# EAGLE design e407-eth-jack-replacment (EAGLE 6.4)
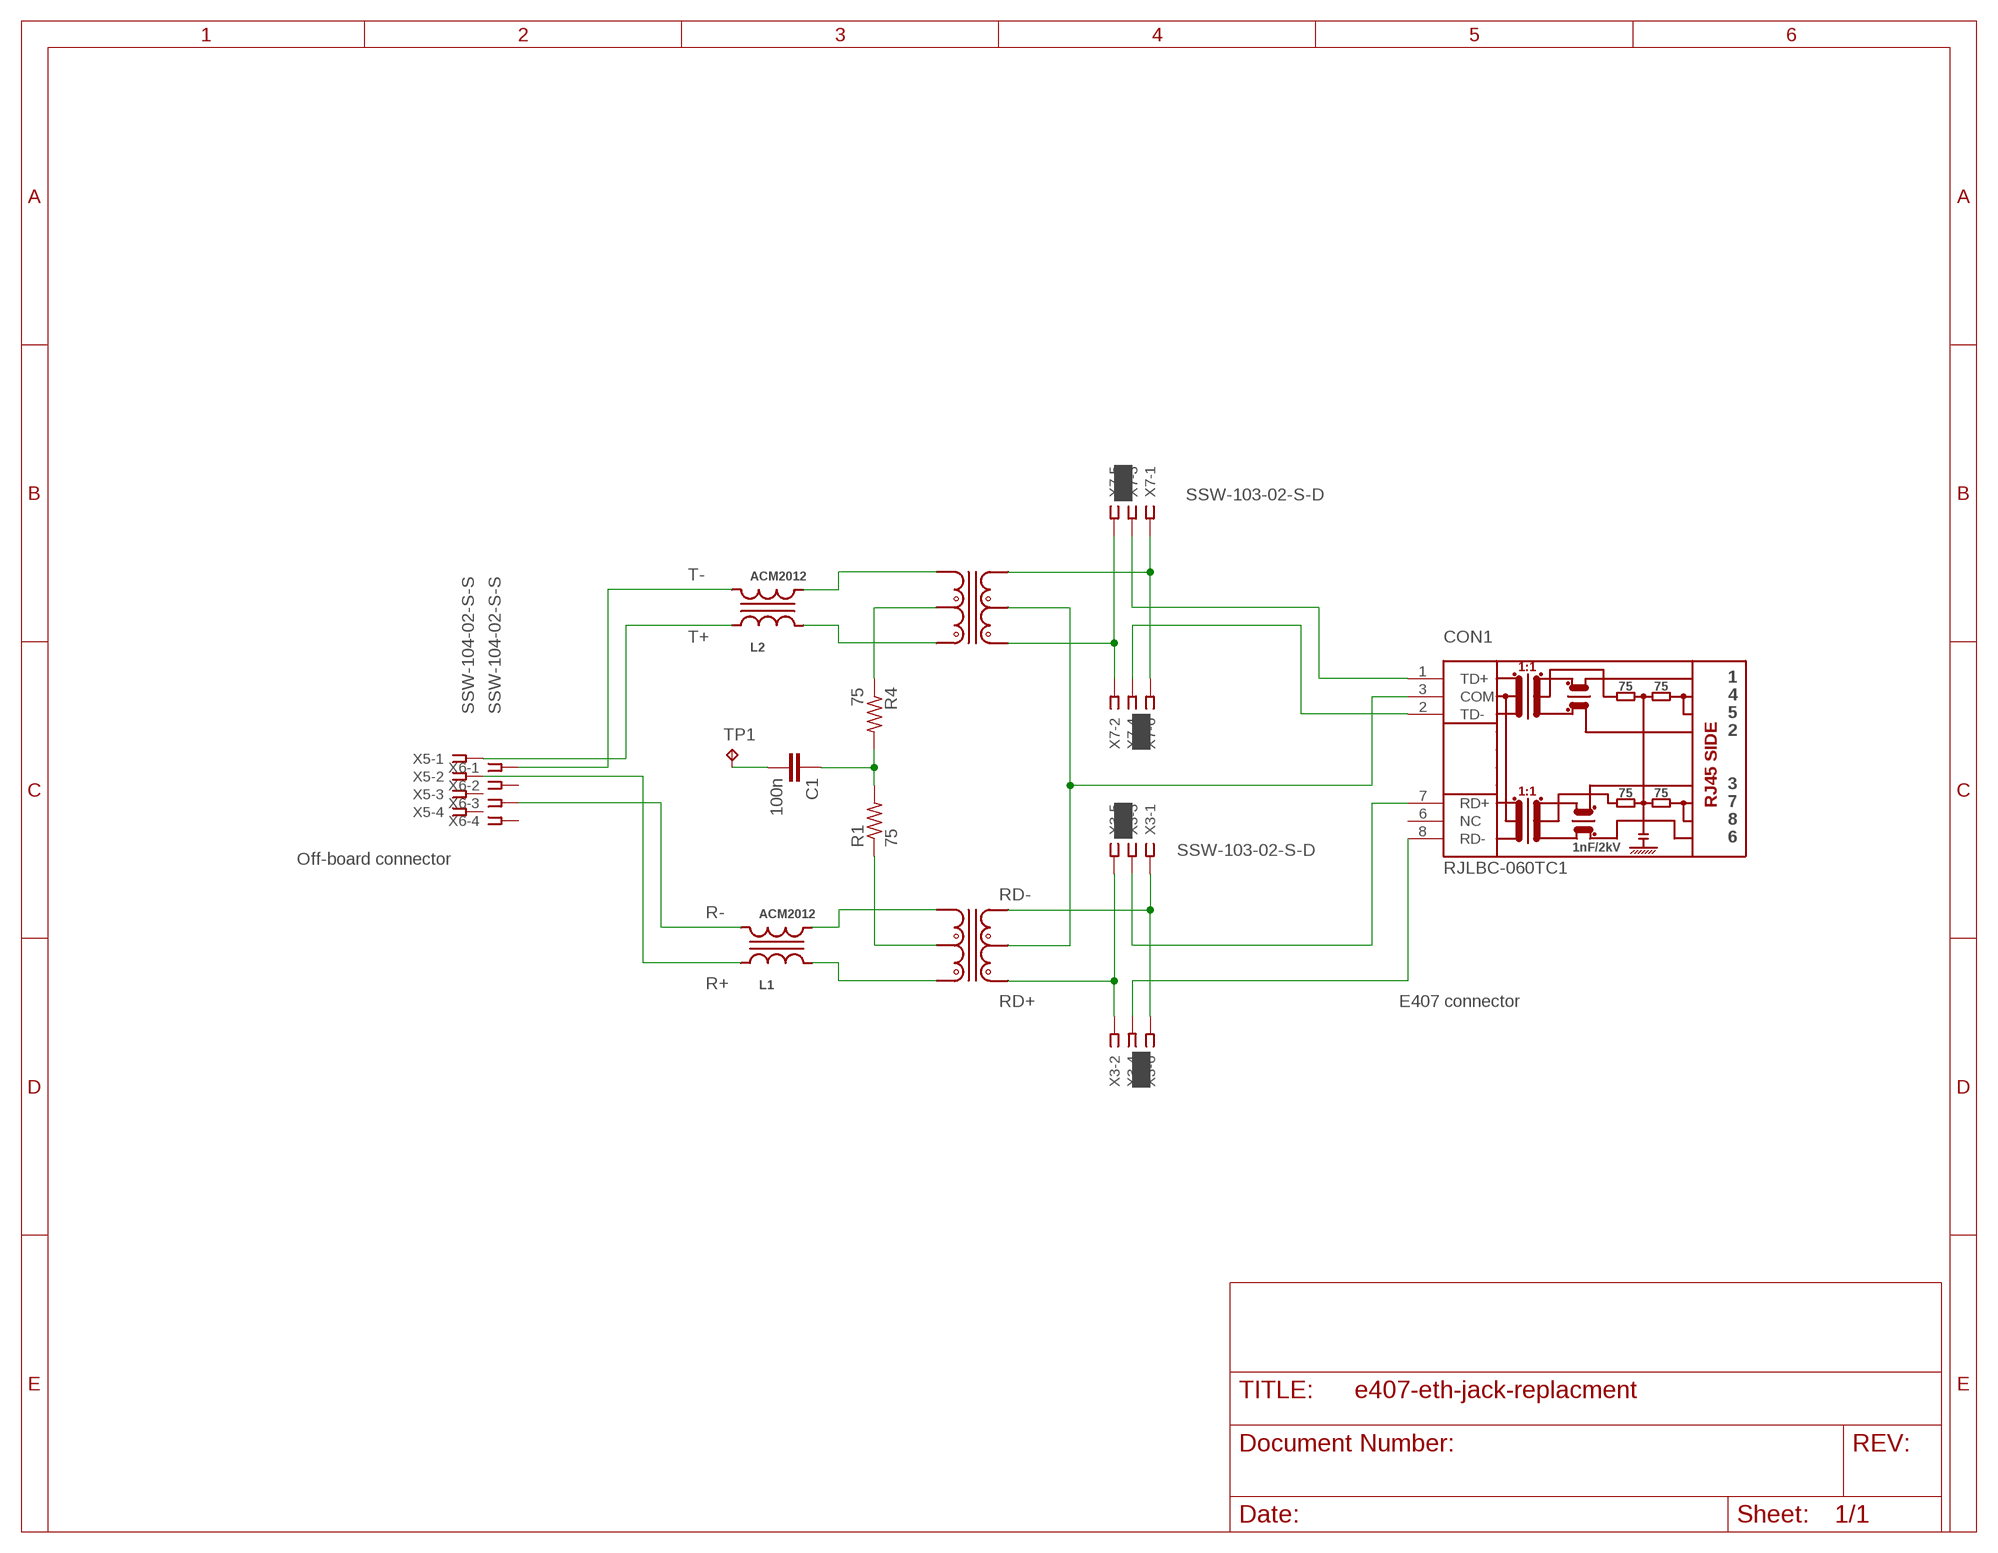
[diagram p0: schematic, sheet 1]

## Parts
C1  100n  C-EU0603-B-NOSILK  [0603-B-NOSILK]
CON1  RJLBC-060TC1  [RJLBC-060TC1]
L1  ACM2012  [TDK-ACM2012]
L2  ACM2012  [TDK-ACM2012]
R1  75  R-US_0603-B-NOSILK  [0603-B-NOSILK]
R4  75  R-US_0603-B-NOSILK  [0603-B-NOSILK]
T1  ALT4532  [TDK-ALT4532]
T2  ALT4532  [TDK-ALT4532]
TP1  TPPAD1-13  [P1-13]
X3  SSW-103-02-S-D  [SSW-103-02-S-D]
X5  SSW-104-02-S-S  [SSW-104-02-S-S]
X6  SSW-104-02-S-S  [SSW-104-02-S-S]
X7  SSW-103-02-S-D  [SSW-103-02-S-D]

## Nets
N$1: L1.3 T1.4
N$2: L2.4 T2.5
N$3: L2.1 X5.1
N$4: C1.1 R1.2 R4.2
N$5: L1.4 T1.5
N$6: CON1.8(RD-) X3.4
N$7: T1.2 X3.1 X3.6
N$9: T1.1 X3.2 X3.5
N$11: CON1.7(RD+) X3.3
N$12: CON1.1(TD+) X7.3
N$13: T2.1 X7.2 X7.5
N$14: L2.3 T2.4
N$15: L1.2 X6.3
N$17: L2.2 X6.1
N$18: C1.2 TP1.TP
N$21: CON1.2(TD-) X7.4
N$22: R4.1 T2.3
N$24: L1.1 X5.2
N$26: R1.1 T1.3
N$27: CON1.3(COM) T1.6 T2.6
N$31: T2.2 X7.1 X7.6
Unconnected: CON1.6(NC) X5.3 X5.4 X6.2 X6.4

## Notes on the sheet
- T-
- T+
- Off-board connector
- RD-
- R-
- R+
- RD+ | E407 connector

## Library data of the parts
C1 = rcl_custom:C-EU: CAPACITOR, European symbol
CON1 = OLIMEX_CONNECTORS:RJLBC-060TC1
L1 L2 = magnetics:ACM2012
R1 R4 = rcl_custom:R-US_: RESISTOR, American symbol
T1 T2 = alt4532:ALT4532
TP1 = testpad:TP: Test pad
X3 X7 = con-samtec:SSW-103-02-S-D: THROUGH-HOLE .025" SQ POST SOCKET Source: Samtec SSW.pdf; MPN: SSW-103-02-S-D; OC_FARNELL: unknown; OC_NEWARK: 11P9365
X5 X6 = con-samtec:SSW-104-02-S-S: THROUGH-HOLE .025" SQ POST SOCKET Source: Samtec SSW.pdf; MPN: SSW-104-02-S-S; OC_FARNELL: unknown; OC_NEWARK: 11P9384

## Board
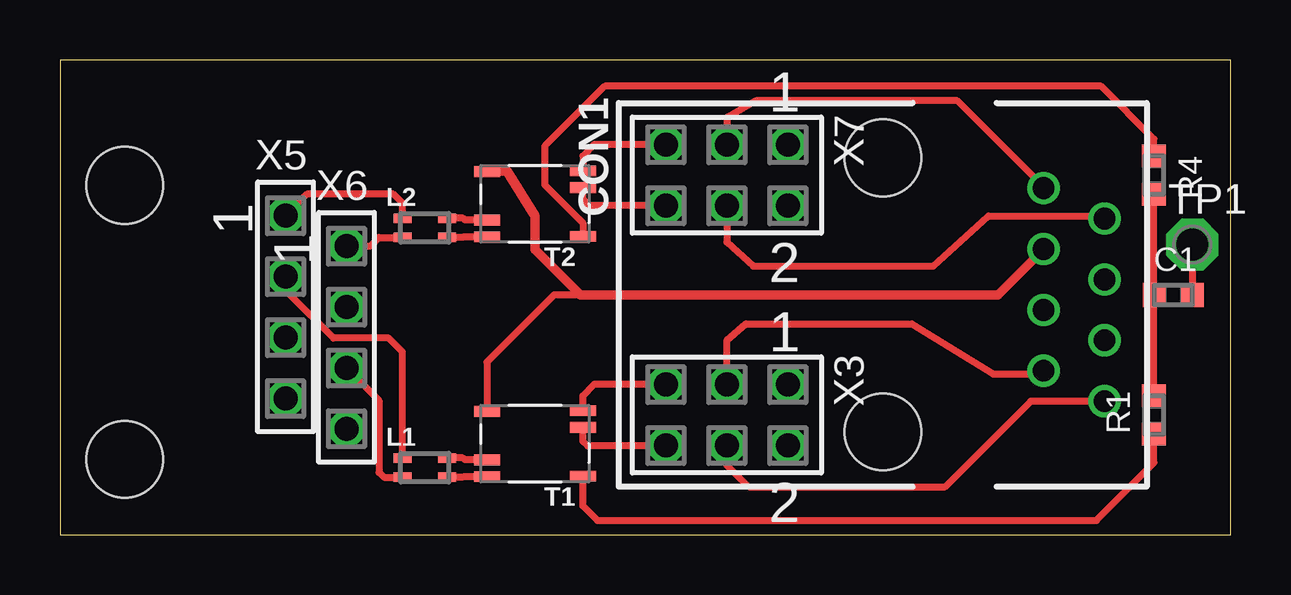
[diagram p1: board, top side]
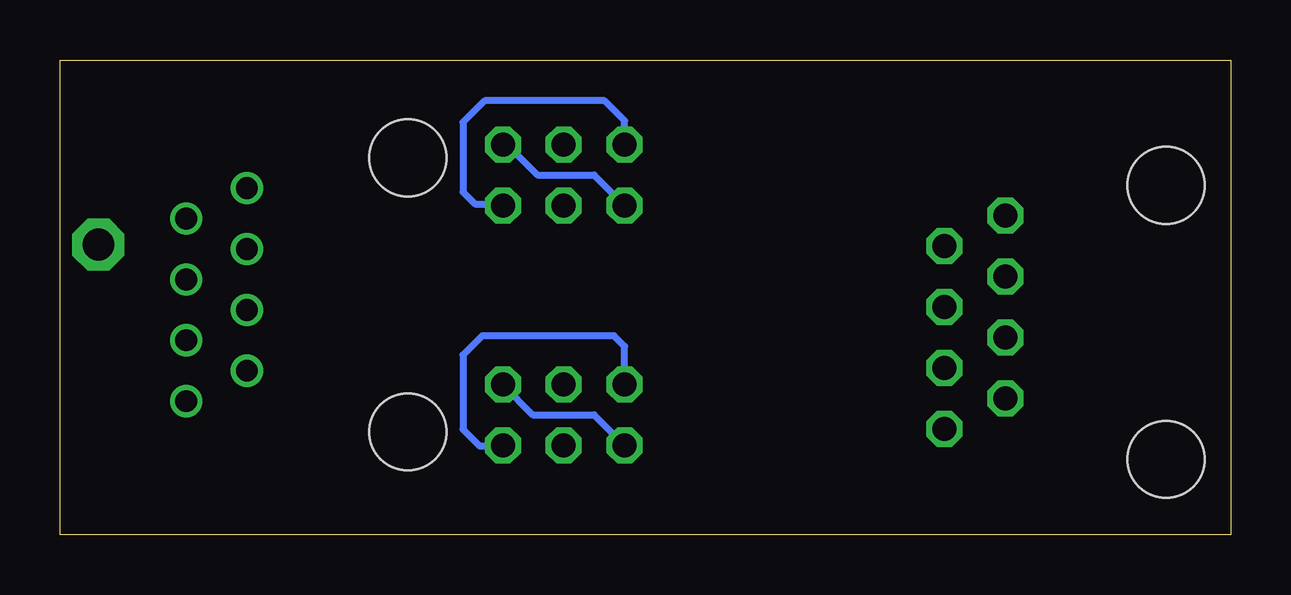
[diagram p2: board, bottom side, seen from below]

Size 48.8 x 19.8 mm. Coordinates in mm from the lower left corner, seen from the top.
Outline: 0,0 48.8,0 48.8,19.8 0,19.8 0,0
Copper layers (1*16): Top 0.0178mm / dielectric 59mil / Bottom 0.0178mm
Design rules "epl-lpkf": minimum track width 8mil, minimum drill 0.35mm, track to track 8mil, track to pad 8mil, pad to pad 8mil, via to via 8mil, smd to smd 8mil, copper to edge 15mil, drill to drill 15mil, minimum pad ring 8mil, minimum via ring 8mil, stop-mask expansion 3mil, vias tented up to drill 0mil, thermal gap 10mil
Holes 3.2 mm at 2.69,14.57 2.69,3.15

### Footprints (pad centres in the part's own frame; a part is rotated, then mirrored left to right if it is on the bottom)
0603-B-NOSILK = smd 0.95 x 1: 1 -0.8,0; 2 0.8,0
RJLBC-060TC1 = drill 0.9: 1 -4.455,6.7; 2 -3.185,9.24; 3 -1.915,6.7; 4 -0.645,9.24; 5 0.625,6.7; 6 1.895,9.24; 7 3.165,6.7; 8 4.435,9.24 | hole 3.2: -5.715,0; 5.715,0
TDK-ACM2012 = smd 0.75 x 0.4: 1 -0.925,0.4; 2 -0.925,-0.4; 3 0.925,-0.4; 4 0.925,0.4
TDK-ALT4532 = smd 1.1 x 0.45: 1 -2,-1.375; 2 -2,-0.675; 3 -2,1.35; 4 2,1.375; 5 2,0.675; 6 2,-1.35
P1-13 = drill 1.321 pad 2.159 octagon: TP 0,0
SSW-103-02-S-D = drill 1 pad 1.5 octagon: 1 -2.54,-1.27; 2 -2.54,1.27; 3 0,-1.27; 4 0,1.27; 5 2.54,-1.27; 6 2.54,1.27
SSW-104-02-S-S = drill 1 pad 1.5 octagon: 1 -3.81,0; 2 -1.27,0; 3 1.27,0; 4 3.81,0

### Placement (x,y rotation side)
C1  46.4,10 0 top
CON1  34.3,10 270 top
L1  15.2,2.8 0 top
L2  15.2,12.8 0 top
R1  45.6,5 90 top
R4  45.6,15 270 top
T1  19.8,3.8 180 top
T2  19.8,13.8 180 top
TP1  47.2,12.1 0 top
X3  27.8,5 180 top
X5  9.4,9.5 270 top
X6  11.94,8.23 270 top
X7  27.8,15 180 top

### Tracks (layer width: path | path; a pad name or v marks a point on that pad's centre or on a via)
N$1
  Top 0.3: T1.4 16.82,2.42 16.8,2.4 L1.3
N$2
  Top 0.3: T2.5 16.88,13.12 16.8,13.2 L2.4
N$3
  Top 0.3: L2.1 14.28,13.82 13.9,14.2 10.29,14.2 X5.1
N$4
  Top 0.3: R1.2 C1.1 R4.2
N$5
  Top 0.3: T1.5 16.88,3.12 16.8,3.2 L1.4
N$6
  Top 0.3: CON1.8 40.47,5.57 36.9,2 28.7,2 27.8,2.9 X3.4
N$7
  Top 0.3: X3.6 25.23,3.7 22,3.7 21.8,3.9 T1.2
  Bottom 0.3: X3.1 30.34,6.24 29.1,5 26.53,5 X3.6
N$9
  Top 0.3: X3.5 22.27,6.27 21.8,5.8 T1.1
  Bottom 0.3: X3.5 25.26,7.86 25.7,8.3 31.2,8.3 32,7.5 32,4.4 31.3,3.7 30.37,3.7 X3.2
N$11
  Top 0.3: X3.3 27.8,8.1 28.6,8.8 35.5,8.8 38.9,6.7 40.87,6.7 CON1.7
N$12
  Top 0.3: CON1.1 41.05,14.46 37.4,18.1 29,18.1 27.8,17.4 X7.3
N$13
  Top 0.3: X7.5 22.27,16.27 21.8,15.8 T2.1
  Bottom 0.3: X7.5 25.26,17.26 26.1,18.1 31.1,18.1 32,17.2 32,14.3 31.5,13.8 30.41,13.8 X7.2
N$14
  Top 0.3: T2.4 16.82,12.43 16.8,12.4 L2.3
N$15
  Top 0.3: X6.3 13.3,5.6 13.3,2.6 13.5,2.4 L1.2
N$17
  Top 0.3: X6.1 12.94,12.04 13.3,12.4 L2.2
N$18
  Top 0.3: TP1.TP C1.2
N$21
  Top 0.3: X7.4 27.8,12.2 28.9,11.2 36.4,11.2 38.7,13.3 43.42,13.3
  Top 0.406: 43.42,13.3 CON1.2
N$22
  Top 0.3: T2.3 21.8,13 20.2,14.6 20.2,16.2 22.7,18.7 43.4,18.7 45.6,16.5 R4.1
N$24
  Top 0.3: L1.1 14.28,7.62 13.7,8.2 11.4,8.2 9.6,10 9.6,10.57 X5.2
N$26
  Top 0.3: R1.1 45.6,3 43.2,0.6 22.4,0.6 21.8,1.2 T1.3
N$27
  Top 0.3: 21.7,10 20.6,10 17.8,7.2 T1.6
  Top 0.4: CON1.3 39.09,10 21.7,10 19.8,11.9 19.8,13.3 18.63,15.17 T2.6
N$31
  Top 0.3: X7.6 22.07,13.73 21.8,14 T2.2
  Bottom 0.3: X7.1 30.17,16.27 28.9,15 26.53,15 X7.6

### Text on the board
Reference: 1 = T+ / 2 = T- / 3 = R+ / 6 = R- | T+ | 1 | 2 | T- | R+ | R- | 7 | 8